# Altium schematic sheet DC_DC_HBridge.SchDoc
size A4
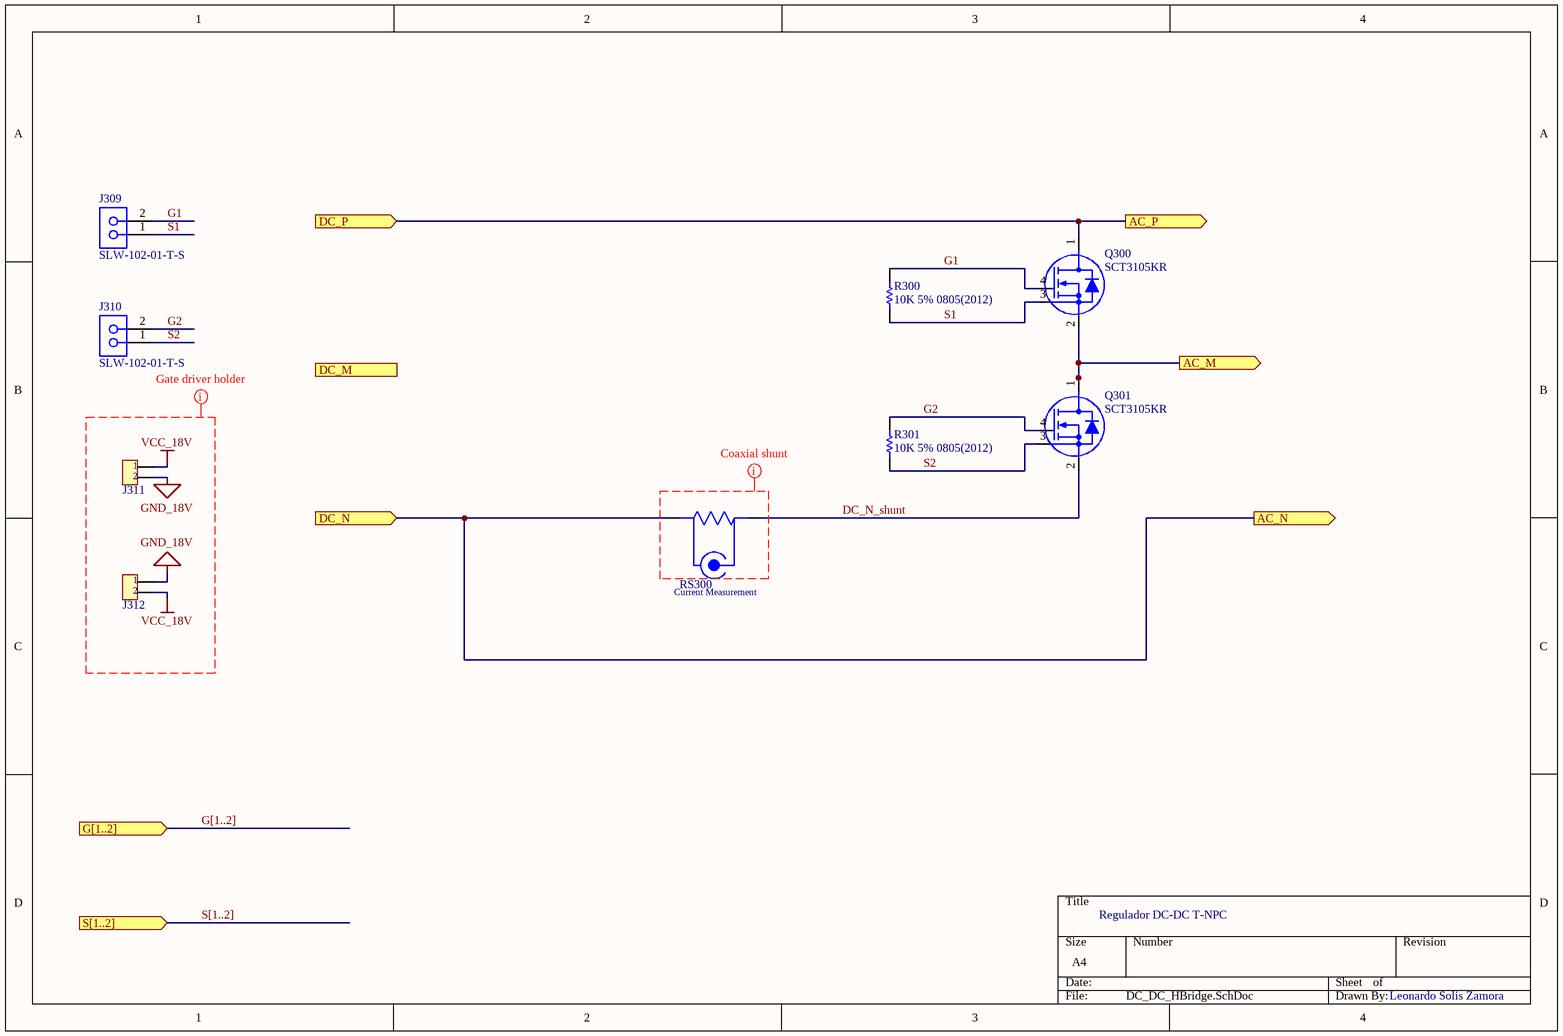
[diagram p0: DC_DC_HBridge.SchDoc]

## Parts
J309  SLW-102-01-T-S  [SMTC-SLW-102-01-X-S]
J310  SLW-102-01-T-S  [SMTC-SLW-102-01-X-S]
J311  SSM-102-L-SV  [SSM-102-L-SV]  (value not drawn)
J312  SSM-102-L-SV  [SSM-102-L-SV]  (value not drawn)
Q300  SCT3105KR  [TO-247-4L_hsa]
Q301  SCT3105KR  [TO-247-4L_hsa]
R300  10K 5% 0805(2012)  [RESC0805(2012)_L]
R301  10K 5% 0805(2012)  [RESC0805(2012)_L]
RS300  SDN-414  [SDN-414]  (value not drawn)

## Ports
AC_M (out), AC_N (out), AC_P (out), DC_M (in), DC_N (in), DC_P (in), G[1..2] (in), S[1..2] (in)

## Nets
GND_18V: J311.2 J312.1
VCC_18V: J311.1 J312.2
AC_M: Q300.2(S) Q301.1(D) ; port AC_M
AC_N: RS300.1(-) ; port DC_N, port AC_N
AC_P: Q300.1(D) ; port DC_P, port AC_P
DC_N_shunt: Q301.2(S) RS300.2(+)
G1: J309.2 Q300.4(G) R300.1
G2: J310.2 Q301.4(G) R301.1
S1: J309.1 Q300.3(KS) R300.2
S2: J310.1 Q301.3(KS) R301.2

## Buses and harness runs
bus G[1..2] = port G[1..2]
bus S[1..2] = port S[1..2]

## Layout directives
mark named Coaxial shunt: (no net found under the mark)
mark named Gate driver holder: GND_18V, VCC_18V

## Notes on the sheet
- Current Measurement
- Regulador DC-DC T-NPC
- Leonardo Solis Zamora

## Library data of the parts
J309 J310 = CMP-1023-00124-1: Low Profile Socket Strips, Through-hole, Vertical, -55 to 105 degC, 2.54 mm Pitch, 2-Pin, Female, RoHS; Manufacturer: Samtec; Pitch: 2.54 mm; System: Connector; ComponentLink2Description: Datasheet; PackageReference: SLW-102-01-X-S; Orientation: Vertical; PartNumber: SLW-102-01-T-S; ComponentLink3URL: http://www.samtec.com/documents/webfiles/cpdf/SLW-1XX-01-X-X-MKT.pdf; DatasheetVersion: F-214; Mounting Technology: Through-hole; ComponentLink3Description: Package Specification; ComponentLink2URL: http://www.samtec.com/documents/webfiles/pdf/SLW.PDF; PackageDescription: Low Profile Socket Strip; Temperature Range: -55 to 105 degC; ComponentLink1Description: Manufacturer URL; PackageVersion: X, 9/1987; RoHS: True; ComponentLink1URL: http://www.samtec.com
J311 J312 = SSM-102-L-SV: SAMTEC - SSM-102-L-SV - RECEPTACLE, 2.54MM, VERT, 2WAY; Number of Contacts: 2; Contact Resistance: 10mR; Max Voltage Rating (AC): 475V; Max Current Rating: 6.9A; Connector Type: Receptacle,Socket; Supplier 1: Digi-Key; Manufacturer: Samtec; Manufacturer Part Number: SSM-102-L-SV; RoHS: Yes; Category: Headers and Wire Housings; Stock 1: 51; Pricing 1: 1=0.56000, 10=0.52100, 25=0.46920, 50=0.41700, 100=0.39960, 250=0.36488, 500=0.34752 (USD); Mount: Surface Mount; Contact Plating: Gold; Contact Material: Bronze; Housing Material: Polymer; Housing Color: Black; Color: Black; Min Operating Temperature: -55°C; Max Operating Temperature: 125°C; Termination: Solder; Number of Rows: 1; Packaging: Bulk; Gender: Receptacle; Orientation: Straight; Current Rating: 6.9A; Number of Positions: 2; Voltage Rating: 475V; Voltage Rating (AC): 475V; Length: 5.08mm; Pitch: 2.54mm; Depth: 2.54mm; Lead Pitch: 2.54mm; Radiation Hardening: No; Lead Free: Lead Free; REACH SVHC: No SVHC; ComponentLink1URL: https://datasheet.ciiva.com/25617/0900766b811594ab-25617394.pdf?src-supplier=RSComponents; ComponentLink1Description: https://datasheet.ciiva.com/25617/0900766b811594ab-25617394.pdf?src-supplier=RSComponents; ComponentLink2URL: https://datasheet.ciiva.com/746/ssm-1xx-xxx-xx-xx-xx-x-xx-xx-mkt-746741.pdf?src-supplier=Digi-Key; ComponentLink2Description: https://datasheet.ciiva.com/746/ssm-1xx-xxx-xx-xx-xx-x-xx-xx-mkt-746741.pdf?src-supplier=Digi-Key; ComponentLink3URL: https://datasheet.ciiva.com/22677/81944-22677814.pdf?src-supplier=Element14; ComponentLink3Description: https://datasheet.ciiva.com/22677/81944-22677814.pdf?src-supplier=Element14; Supplier Part Number 1: SAM1148-02-ND
Q300 Q301 = SCT3105KR: N-channel SiC power MOSFET ROHM. Vdss 1200V, Rdson 105mOhm, Id 24A; Rds on @ Id, Vgs: 137 mOhm; Drive Voltage: 18 V; Gate Charge (Qg) (Max) @ Vds: 51 nC; Vgs Max: +22 V / -4 V; Input Capacitance (Ciss) (Max) @ Vds: 574pF @ 800V; Supplier 1: Mouser; Supplier 2: Digi-Key; Supplier 3: Farnell; Supplier 4: Newark; Supplier Part Number 4: 34AH2699; Supplier Part Number 3: 3241766; Supplier Part Number 2: 846-SCT3105KRC14-ND; Supplier Part Number 1: 755-SCT3105KRC14; FET type: N-Channel; Technology: SiC-FET; Drain-to-source voltage (Vdss): 1200 V; Current - continuous drain (Id) @ 25°C: 24 A; Package/Case: TO-247-4
R300 R301 = CMP-1013-00098-1: 10K 0.125W 5% 0805 (2012 Metric)  SMD; Case-EIA: 0805; Case-Metric: 2012; Value: 10000.00 Ohm; Power: 0.125 W; Technology: SMT; Tolerance: 5 %
RS300 = SDN-414: Coaxial current shunt SDN-414 T&M (New); Manufacturer: Ohmite; Manufacturer Part Number: WHE10RFET; Resistance: 10R; Power Rating: 5W; Tolerance: 1%; Temperature Coefficient: 50ppm/°C; Lead Diameter: 1mm; Supplier 1: Digi-Key; RoHS: Yes; Category: Through-Hole Resistors; Stock 1: 228; Pricing 1: 1=1.54000, 10=1.36400, 25=1.25400, 50=1.14400, 100=0.99000, 250=0.83600 (USD); Case/Package: Axial; Number of Pins: 2; Weight: 0.080848oz; Min Operating Temperature: -55°C; Max Operating Temperature: 150°C; Number of Terminations: 2; Termination: Axial; Package Quantity: 500; Packaging: Tape and Reel; Composition: Wirewound; Max Power Dissipation: 5W; Diameter: 7.5mm; Length: 20mm; REACH SVHC: Unknown; ComponentLink1URL: https://datasheet.ciiva.com/5635/res-wh-wn-5635598.pdf?src-supplier=Mouser; ComponentLink1Description: https://datasheet.ciiva.com/5635/res-wh-wn-5635598.pdf?src-supplier=Mouser; ComponentLink2URL: https://datasheet.ciiva.com/6495/res-wh-wn-6495224.pdf?src-supplier=Digi-Key; ComponentLink2Description: https://datasheet.ciiva.com/6495/res-wh-wn-6495224.pdf?src-supplier=Digi-Key; ComponentLink3URL: https://datasheet.ciiva.com/6495/res-wh-wn-6495226.pdf?src-supplier=Digi-Key; ComponentLink3Description: https://datasheet.ciiva.com/6495/res-wh-wn-6495226.pdf?src-supplier=Digi-Key; Supplier Part Number 1: WHE10RFETCT-ND